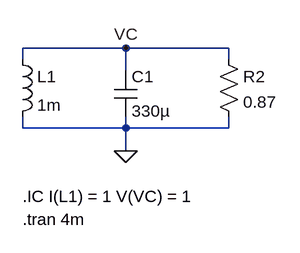
[diagram p0: schematic RLC_aperiodischer_Grenzfall_Schaltplan.asc]
RLC_aperiodischer_Grenzfall_Schaltplan.asc, the LTspice schematic file:
Version 4
SHEET 1 880 680
WIRE 144 176 0 176
WIRE 288 176 144 176
WIRE 0 192 0 176
WIRE 288 192 288 176
WIRE 144 208 144 176
WIRE 0 288 0 272
WIRE 144 288 144 272
WIRE 144 288 0 288
WIRE 288 288 288 272
WIRE 288 288 144 288
WIRE 144 320 144 288
FLAG 144 320 0
FLAG 144 176 VC
SYMBOL ind -16 176 R0
SYMATTR InstName L1
SYMATTR Value 1m
SYMBOL Res 272 176 R0
SYMATTR InstName R2
SYMATTR Value 0.87
SYMBOL Cap 128 208 R0
SYMATTR InstName C1
SYMATTR Value 330µ
TEXT 0 384 Left 2 !.IC I(L1) = 1 V(VC) = 1
TEXT 0 416 Left 2 !.tran 4m

The netlist it stands for:
* RLC_aperiodischer_Grenzfall_Schaltplan.asc
L1 VC 0 1m
R2 VC 0 0.87
C1 VC 0 330µ
.IC I(L1) = 1 V(VC) = 1
.tran 4m
.backanno
.end